# EAGLE design fonte-tensao-ajustavel (EAGLE 9.6.2)
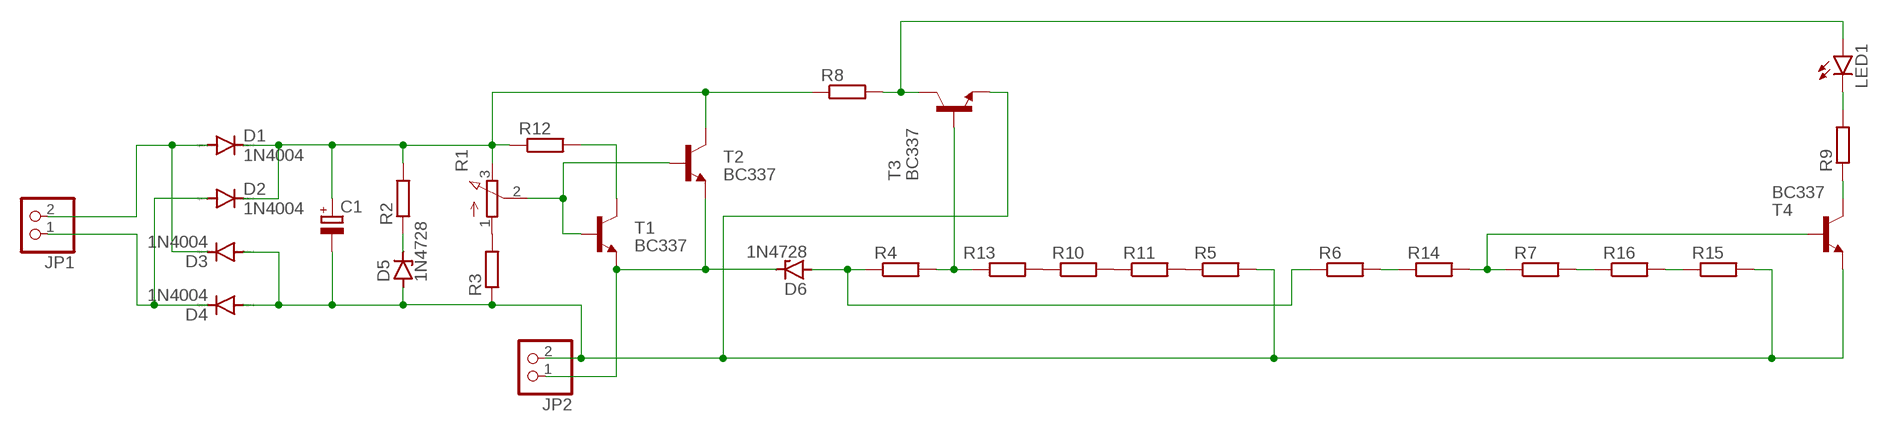
[diagram p0: schematic, sheet 1]

## Parts
C1  CPOL-EUE5-10.5  [E5-10,5]
D1  1N4004  [DO41-10]
D2  1N4004  [DO41-10]
D3  1N4004  [DO41-10]
D4  1N4004  [DO41-10]
D5  1N4728  [DO41Z10]
D6  1N4728  [DO41Z10]
JP1  PINHD-1X2  [1X02]
JP2  PINHD-1X2  [1X02]
LED1  LED5MM  [LED5MM]
R1  3RP/1610N  [3RP/1610N]
R2  R-EU_0204/7  [0204/7]
R3  R-EU_0204/7  [0204/7]
R4  R-EU_0204/7  [0204/7]
R5  R-EU_0204/7  [0204/7]
R6  R-EU_0204/7  [0204/7]
R7  R-EU_0204/7  [0204/7]
R8  R-EU_0204/7  [0204/7]
R9  R-EU_0204/7  [0204/7]
R10  R-EU_0204/7  [0204/7]
R11  R-EU_0204/7  [0204/7]
R12  R-EU_0414/15  [0414/15]
R13  R-EU_0204/7  [0204/7]
R14  R-EU_0204/7  [0204/7]
R15  R-EU_0204/7  [0204/7]
R16  R-EU_0204/7  [0204/7]
T1  BC337  [TO92]
T2  BC337  [TO92]
T3  BC337  [TO92]
T4  BC337  [TO92]

## Nets
N$1: D1.A D3.C JP1.2
N$2: D2.A D4.C JP1.1
N$3: R5.1 R11.2
N$4: C1.- D3.A D4.A D5.A JP2.2 R3.1 R5.2 R15.2 T3.1(E) T4.1(E)
N$5: D5.C R2.1
N$6: R1.1(A) R3.2
N$7: D6.C JP2.1 T1.1(E) T2.1(E)
N$8: R1.2(S) T1.2(B) T2.2(B)
N$9: C1.+ D1.C D2.C R1.3(E) R2.2 R8.1 R12.1 T2.3(C)
N$10: D6.A R4.1 R6.1
N$11: R4.2 R13.1 T3.2(B)
N$12: R7.1 R14.2 T4.2(B)
N$13: LED1.K(C) R9.2
N$14: R9.1 T4.3(C)
N$15: LED1.A R8.2 T3.3(C)
N$16: R12.2 T1.3(C)
N$17: R10.2 R11.1
N$18: R10.1 R13.2
N$19: R6.2 R14.1
N$20: R7.2 R16.1
N$21: R15.1 R16.2

## Library data of the parts
C1 = rcl:CPOL-EU: POLARIZED CAPACITOR, European symbol; SPICEPREFIX: C
D1-D4 = diode:1N4004: DIODE general purpose rectifier, 1 A
D5 D6 = diode:1N4728: Z DIODE 3.3 V, 1W, 5 percent
JP1 JP2 = pinhead:PINHD-1X2: PIN HEADER
LED1 = led:LED: LED OSRAM: - CHIPLED LG R971, LG N971, LY N971, LG Q971, LY Q971, LO R971, LY R971 LH N974, LH R974 LS Q976, LO Q976, LY Q976 LO Q996 - Hyper CHIPLED LW Q18S LB Q993, LB Q99A, LB R99A - SideLED LS A670, LO A670, LY A670, LG A670, LP A670 LB A673, LV A673, LT A673, LW A673 LH A674 LY A675 LS A676, LA A676, LO A676, LY A676, LW A676 LS A679, LY A679, LG A679 - Hyper Micro SIDELED® LS Y876, LA Y876, LO Y876, LY Y876 LT Y87S - SmartLED LW L88C, LW L88S LB L89C, LB L89S, LG L890 LS L89K, LO L89K, LY L89K LS L896, LA L896, LO L896, LY L896 - TOPLED LS T670, LO T670, LY T670, LG T670, LP T670 LSG T670, LSP T670, LSY T670, LOP T670, LYG T670 LG T671, LOG T671, LSG T671 LB T673, LV T673, LT T673, LW T673 LH T674 LS T676, LA T676, LO T676, LY T676, LB T676, LH T676, LSB T676, LW T676 LB T67C, LV T67C, LT T67C, LS T67K, LO T67K, LY T67K, LW E67C LS E67B, LA E67B, LO E67B, LY E67B, LB E67C, LV E67C, LT E67C LW T67C LS T679, LY T679, LG T679 LS T770, LO T770, LY T770, LG T770, LP T770 LB T773, LV T773, LT T773, LW T773 LH T774 LS E675, LA E675, LY E675, LS T675 LS T776, LA T776, LO T776, LY T776, LB T776 LHGB T686 LT T68C, LB T68C - Hyper Mini TOPLED® LB M676 - Mini TOPLED Santana® LG M470 LS M47K, LO M47K, LY M47K Source: http://www.osram.convergy.de LUXEON: - LUMILED® LXK2-PW12-R00, LXK2-PW12-S00, LXK2-PW14-U00, LXK2-PW14-V00 LXK2-PM12-R00, LXK2-PM12-S00, LXK2-PM14-U00 LXK2-PE12-Q00, LXK2-PE12-R00, LXK2-PE12-S00, LXK2-PE14-T00, LXK2-PE14-U00 LXK2-PB12-K00, LXK2-PB12-L00, LXK2-PB12-M00, LXK2-PB14-N00, LXK2-PB14-P00, LXK2-PB14-Q00 LXK2-PR12-L00, LXK2-PR12-M00, LXK2-PR14-Q00, LXK2-PR14-R00 LXK2-PD12-Q00, LXK2-PD12-R00, LXK2-PD12-S00 LXK2-PH12-R00, LXK2-PH12-S00 LXK2-PL12-P00, LXK2-PL12-Q00, LXK2-PL12-R00 Source: www.luxeon.com KINGBRIGHT: KA-3528ASYC Source: www.kingbright.com
R1 = pot:3RP/1610N: 16mm Potentiometer one level Source: http://www.alphapotentiometers.net/html/16mm_pot_2.html
R2-R16 = rcl:R-EU_: RESISTOR, European symbol; SPICEPREFIX: R
T1-T4 = transistor:BC337: NPN TRANSISTOR

## Board
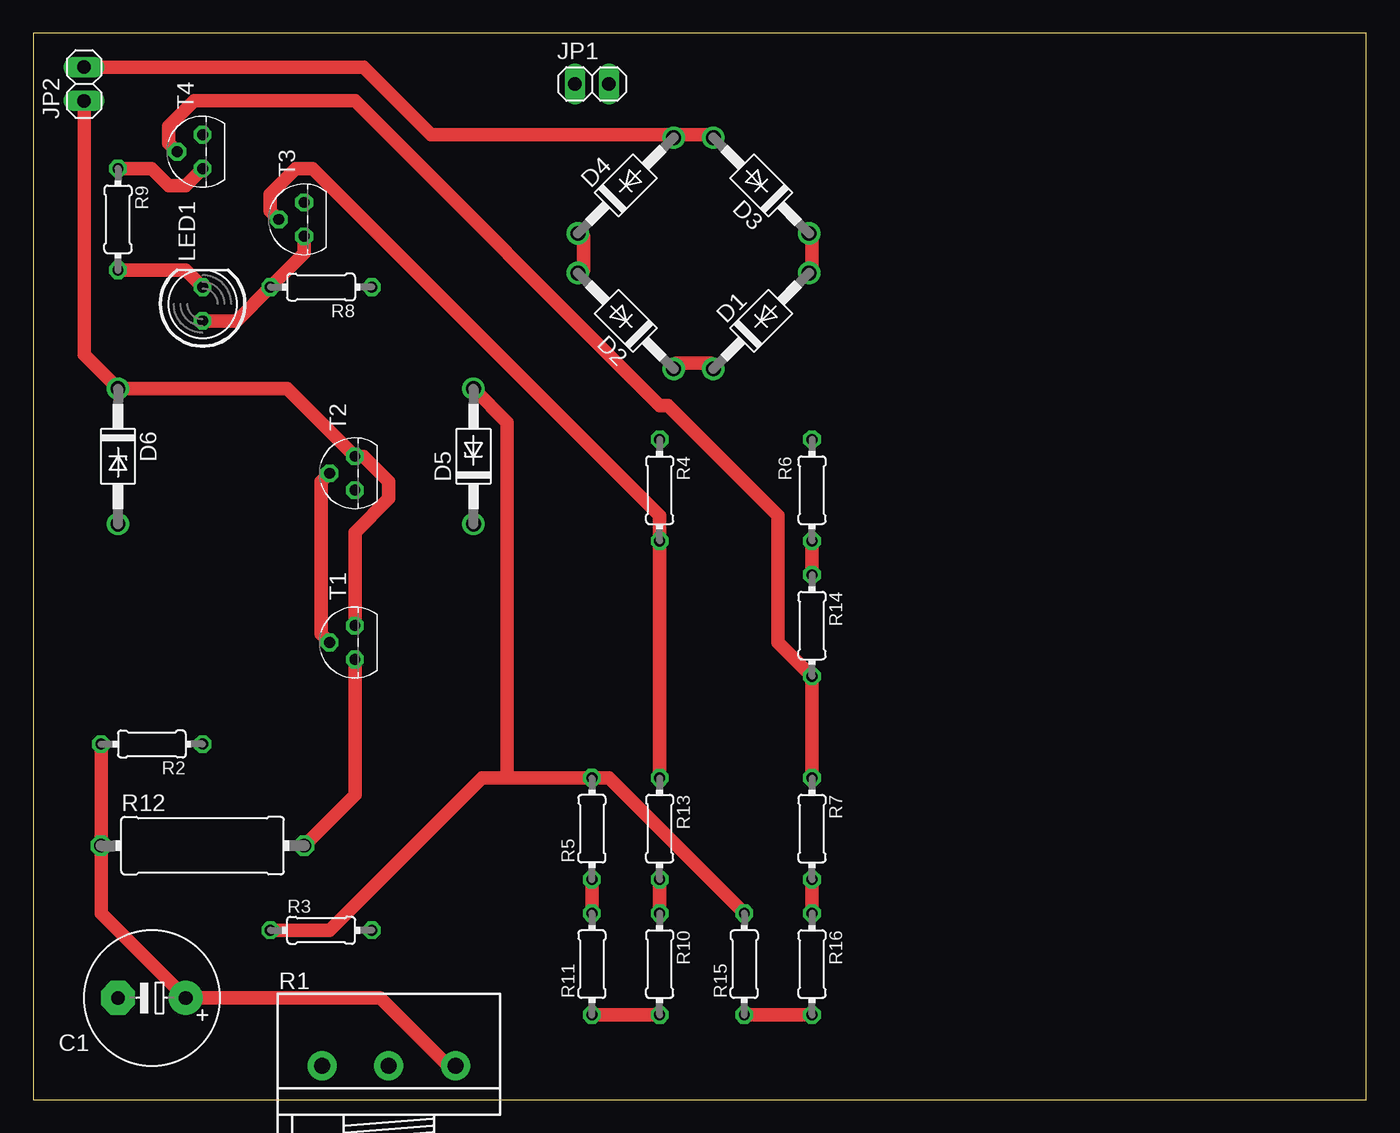
[diagram p1: board, top side]
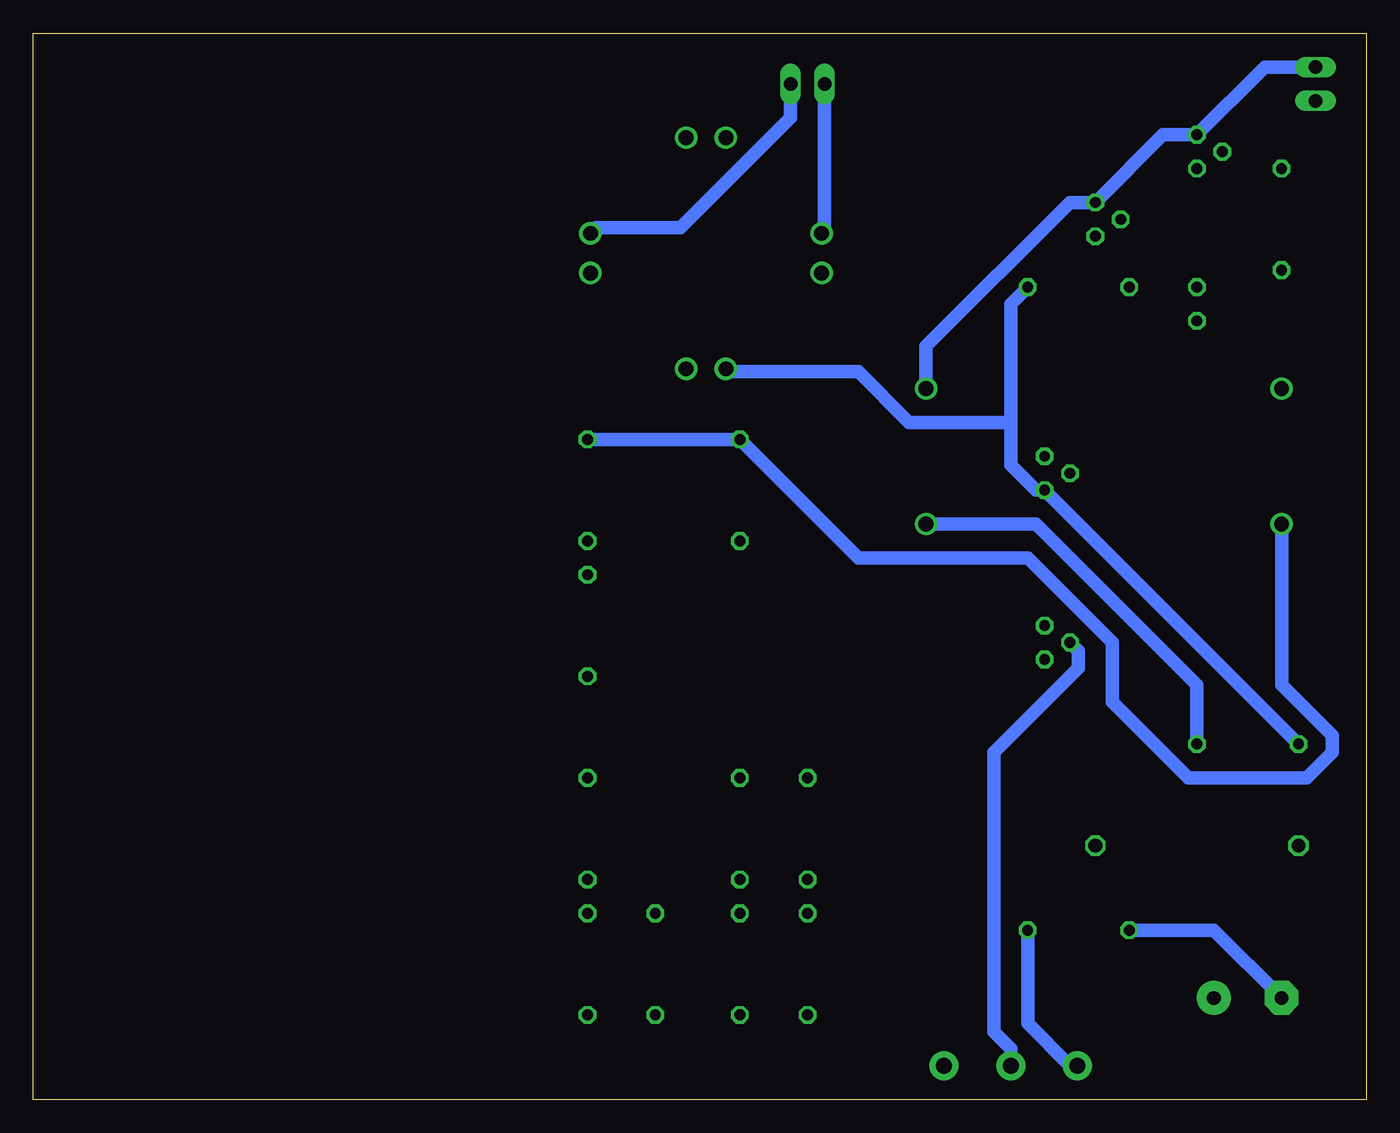
[diagram p2: board, bottom side, seen from below]

Size 100 x 80 mm. Coordinates in mm from the lower left corner, seen from the top.
Outline: 0,0 100,0 100,80 0,80 0,0
Copper layers (1*16): Top 0.035mm / dielectric 1.5mm / Bottom 0.035mm
Design rules "default *": minimum track width 40mil, minimum drill 0.35mm, track to track 40mil, track to pad 40mil, pad to pad 40mil, via to via 40mil, smd to smd 40mil, copper to edge 40mil, drill to drill 40mil, minimum pad ring 10mil, minimum via ring 8mil, stop-mask expansion 4mil, vias tented up to drill 0mil, thermal gap 10mil

### Footprints (pad centres in the part's own frame; a part is rotated, then mirrored left to right if it is on the bottom)
E5-10,5 = drill 1.016 pad 2.54: + -2.54,0 | drill 1.016 pad 2.54 octagon: - 2.54,0
DO41-10 = drill 1.118: A 5.08,0; C -5.08,0
DO41Z10 = drill 1.118: A 5.08,0; C -5.08,0
1X02 = drill 1.016 long: 1 -1.27,0; 2 1.27,0
LED5MM = drill 0.813 octagon: A -1.27,0; K 1.27,0
3RP/1610N = drill 1.2 pad 2.184: 1 -5,0; 2 0,0; 3 5,0
0204/7 = drill 0.813 octagon: 1 -3.81,0; 2 3.81,0
0414/15 = drill 1.016 octagon: 1 -7.62,0; 2 7.62,0
TO92 = drill 0.813 octagon: 1 1.27,0; 2 0,1.905; 3 -1.27,0

### Placement (x,y rotation side)
C1  8.89,7.62 180 top
D1  54.61,58.42 45 top
D2  44.45,58.42 135 top
D3  54.61,68.58 135 top
D4  44.45,68.58 45 top
D5  33.02,48.26 90 top
D6  6.35,48.26 270 top
JP1  41.91,76.2 0 top
JP2  3.81,76.2 90 top
LED1  12.7,59.69 90 top
R1  26.67,2.54 0 top
R2  8.89,26.67 180 top
R3  21.59,12.7 0 top
R4  46.99,45.72 270 top
R5  41.91,20.32 90 top
R6  58.42,45.72 270 top
R7  58.42,20.32 270 top
R8  21.59,60.96 180 top
R9  6.35,66.04 270 top
R10  46.99,10.16 270 top
R11  41.91,10.16 90 top
R12  12.7,19.05 0 top
R13  46.99,20.32 270 top
R14  58.42,35.56 270 top
R15  53.34,10.16 90 top
R16  58.42,10.16 270 top
T1  24.13,34.29 90 top
T2  24.13,46.99 90 top
T3  20.32,66.04 90 top
T4  12.7,71.12 90 top

### Tracks (layer width: path | path; a pad name or v marks a point on that pad's centre or on a via)
N$1
  Top 1.016: D1.A 58.42,62.23 58.42,64.77 D3.C
  Bottom 1.016: JP1.2 43.18,73.66 51.44,65.41 57.78,65.41 D3.C
N$2
  Top 1.016: D2.A 41.27,62.23 41.27,64.77 D4.C
  Bottom 1.016: JP1.1 40.64,65.41 D4.C
N$3
  Top 1.016: R5.1 R11.2
N$4
  Top 1.016: R15.2 43.18,24.13 R5.2 35.56,24.13 | R3.1 22.23,12.7 33.66,24.13 35.56,24.13 | D3.A 50.8,72.39 48.26,72.39 D4.A 47.62,72.39 29.84,72.39 24.77,77.47 JP2.2 | 35.56,24.13 35.56,50.8 D5.A
  Bottom 1.016: R3.1 11.43,12.7 C1.- | JP2.2 7.62,77.47 T4.1 15.24,72.39 T3.1 22.23,67.31 33.02,56.52 D5.A
N$5
  Bottom 1.016: R2.1 12.7,31.11 24.77,43.18 D5.C
N$6
  Bottom 1.016: R3.2 25.4,5.71 22.23,2.54 R1.1
N$7
  Top 1.016: T1.1 24.13,42.55 26.67,45.09 26.67,46.35 24.77,48.26 T2.1 19.05,53.34 D6.C 3.81,55.88 JP2.1
N$8
  Top 1.016: T1.2 21.59,34.92 21.59,46.35 T2.2
  Bottom 1.016: R1.2 26.67,3.81 27.94,5.08 27.94,26.04 21.59,32.38 21.59,33.66 T1.2
N$9
  Top 1.016: D2.C 48.26,55.24 50.8,55.24 D1.C | R2.2 R12.1 5.08,13.97 C1.+ 26.04,7.62 31.11,2.54 R1.3
  Bottom 1.016: 26.67,50.8 26.67,59.69 R8.1 | 26.67,50.8 26.67,47.62 24.77,45.72 T2.3 R2.2 | 26.67,50.8 34.29,50.8 38.1,54.61 47.62,54.61 D2.C
N$10
  Bottom 1.016: R6.1 R4.1 38.1,40.64 25.4,40.64 19.05,34.29 19.05,29.84 13.34,24.13 4.45,24.13 2.54,26.04 2.54,27.3 6.35,31.11 D6.A
N$11
  Top 1.016: R13.1 R4.2 46.99,43.81 20.95,69.85 19.68,69.85 17.78,67.94 17.78,66.67 T3.2
N$12
  Top 1.016: T4.2 10.16,71.75 10.16,73.03 12.06,74.93 24.13,74.93 46.99,52.07 47.62,52.07 55.88,43.81 55.88,34.29 R14.2 R7.1
N$13
  Top 1.016: R9.2 11.43,62.23 LED1.K
N$14
  Top 1.016: R9.1 8.89,69.85 10.16,68.58 11.43,68.58 T4.3
N$15
  Top 1.016: LED1.A 15.24,58.42 R8.2 20.32,63.5 T3.3
N$16
  Top 1.016: T1.3 24.13,22.86 R12.2
N$17
  Top 1.016: R10.2 R11.1
N$18
  Top 1.016: R13.2 R10.1
N$19
  Top 1.016: R6.2 R14.1
N$20
  Top 1.016: R7.2 R16.1
N$21
  Top 1.016: R16.2 R15.1